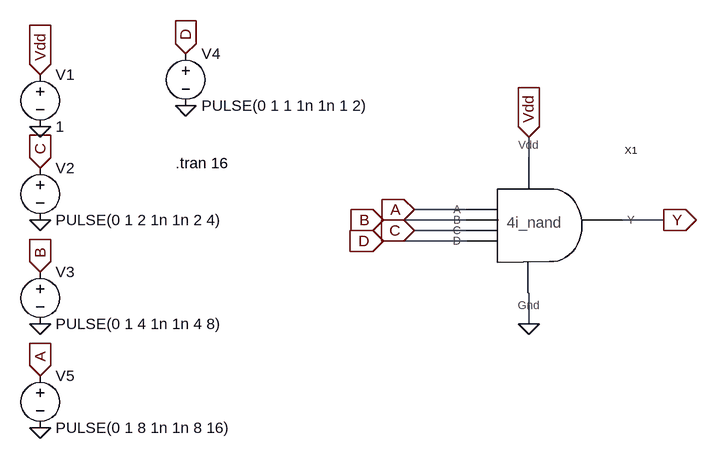
[diagram p0: schematic 4i_nand_test.asc]
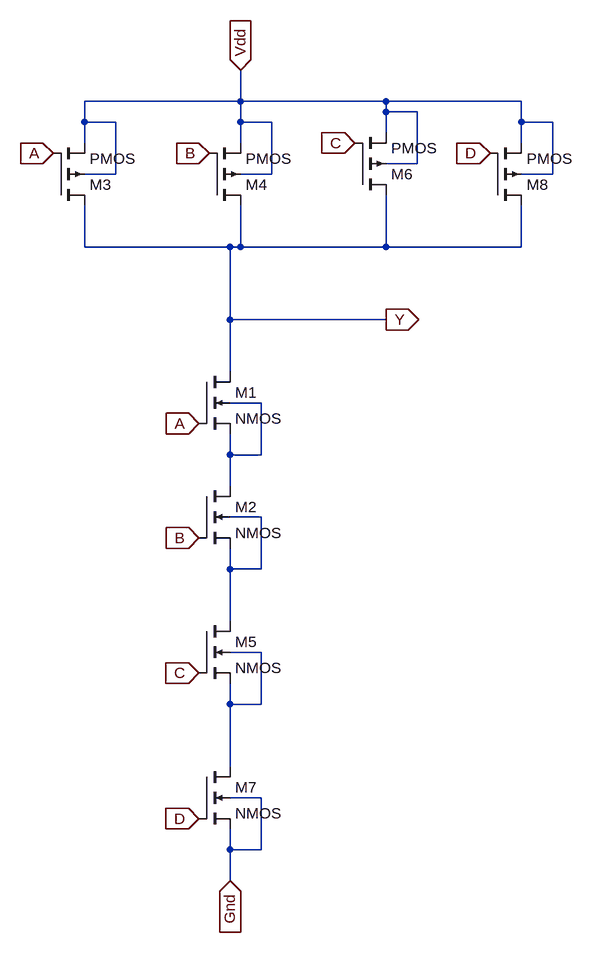
[diagram p1: sub-circuit 4inand.asc]
4i_nand_test.asc, the LTspice schematic file:
Version 4
SHEET 1 880 680
WIRE 288 64 288 32
WIRE 192 144 112 144
WIRE 192 160 64 160
WIRE 496 160 432 160
WIRE 192 176 112 176
WIRE 192 192 64 192
WIRE 288 320 288 272
FLAG 112 144 A
IOPIN 112 144 In
FLAG 64 160 B
IOPIN 64 160 In
FLAG 112 176 C
IOPIN 112 176 In
FLAG 64 192 D
IOPIN 64 192 In
FLAG 288 320 0
FLAG 288 32 Vdd
IOPIN 288 32 In
FLAG 496 160 Y
IOPIN 496 160 Out
FLAG -464 -64 Vdd
IOPIN -464 -64 In
FLAG -464 80 C
IOPIN -464 80 In
FLAG -464 240 B
IOPIN -464 240 In
FLAG -464 16 0
FLAG -464 160 0
FLAG -464 320 0
FLAG -240 -96 D
IOPIN -240 -96 In
FLAG -240 -16 0
FLAG -464 400 A
IOPIN -464 400 In
FLAG -464 480 0
SYMBOL 4inand 272 144 R0
SYMATTR InstName X1
SYMBOL voltage -464 -80 R0
SYMATTR InstName V1
SYMATTR Value 1
SYMBOL voltage -464 64 R0
WINDOW 123 0 0 Left 0
WINDOW 39 0 0 Left 0
SYMATTR InstName V2
SYMATTR Value PULSE(0 1 2 1n 1n 2 4)
SYMBOL voltage -464 224 R0
WINDOW 123 0 0 Left 0
WINDOW 39 0 0 Left 0
SYMATTR InstName V3
SYMATTR Value PULSE(0 1 4 1n 1n 4 8)
SYMBOL voltage -240 -112 R0
WINDOW 123 0 0 Left 0
WINDOW 39 0 0 Left 0
SYMATTR InstName V4
SYMATTR Value PULSE(0 1 1 1n 1n 1 2)
SYMBOL voltage -464 384 R0
WINDOW 123 0 0 Left 0
WINDOW 39 0 0 Left 0
SYMATTR InstName V5
SYMATTR Value PULSE(0 1 8 1n 1n 8 16)
TEXT -256 72 Left 2 !.tran 16

4inand.asc, the sub-circuit schematic file:
Version 4
SHEET 1 880 776
WIRE 112 -528 112 -576
WIRE 112 -528 -128 -528
WIRE 336 -528 112 -528
WIRE 544 -528 336 -528
WIRE 336 -512 336 -528
WIRE 384 -512 336 -512
WIRE -128 -496 -128 -528
WIRE -80 -496 -128 -496
WIRE 112 -496 112 -528
WIRE 160 -496 112 -496
WIRE 544 -496 544 -528
WIRE 592 -496 544 -496
WIRE 336 -480 336 -512
WIRE -128 -464 -128 -496
WIRE 112 -464 112 -496
WIRE 544 -464 544 -496
WIRE 384 -432 384 -512
WIRE 384 -432 336 -432
WIRE -80 -416 -80 -496
WIRE -80 -416 -128 -416
WIRE 160 -416 160 -496
WIRE 160 -416 112 -416
WIRE 592 -416 592 -496
WIRE 592 -416 544 -416
WIRE -128 -304 -128 -368
WIRE 96 -304 -128 -304
WIRE 112 -304 112 -368
WIRE 112 -304 96 -304
WIRE 336 -304 336 -384
WIRE 336 -304 112 -304
WIRE 544 -304 544 -368
WIRE 544 -304 336 -304
WIRE 96 -192 96 -304
WIRE 336 -192 96 -192
WIRE 96 -112 96 -192
WIRE 144 -64 96 -64
WIRE 96 16 96 -16
WIRE 144 16 144 -64
WIRE 144 16 96 16
WIRE 96 64 96 16
WIRE 144 112 96 112
WIRE 96 192 96 160
WIRE 144 192 144 112
WIRE 144 192 96 192
WIRE 96 272 96 192
WIRE 144 320 96 320
WIRE 96 400 96 368
WIRE 144 400 144 320
WIRE 144 400 96 400
WIRE 96 496 96 400
WIRE 144 544 96 544
WIRE 96 624 96 592
WIRE 144 624 144 544
WIRE 144 624 96 624
WIRE 96 672 96 624
FLAG 48 144 B
IOPIN 48 144 In
FLAG 48 -32 A
IOPIN 48 -32 In
FLAG -176 -448 A
IOPIN -176 -448 In
FLAG 64 -448 B
IOPIN 64 -448 In
FLAG 336 -192 Y
IOPIN 336 -192 Out
FLAG 112 -576 Vdd
IOPIN 112 -576 In
FLAG 48 352 C
IOPIN 48 352 In
FLAG 288 -464 C
IOPIN 288 -464 In
FLAG 96 672 Gnd
IOPIN 96 672 In
FLAG 48 576 D
IOPIN 48 576 In
FLAG 496 -448 D
IOPIN 496 -448 In
SYMBOL nmos4 48 -112 R0
SYMATTR InstName M1
SYMBOL nmos4 48 64 R0
SYMATTR InstName M2
SYMBOL pmos4 -176 -368 M180
SYMATTR InstName M3
SYMBOL pmos4 64 -368 M180
SYMATTR InstName M4
SYMBOL nmos4 48 272 R0
SYMATTR InstName M5
SYMBOL pmos4 288 -384 M180
SYMATTR InstName M6
SYMBOL nmos4 48 496 R0
SYMATTR InstName M7
SYMBOL pmos4 496 -368 M180
SYMATTR InstName M8

The netlist it stands for:
* 4i_nand_test.asc
XX1 A B C D Vdd 0 Y 4inand
V1 Vdd 0 1
V2 C 0 PULSE(0 1 2 1n 1n 2 4)
V3 B 0 PULSE(0 1 4 1n 1n 4 8)
V4 D 0 PULSE(0 1 1 1n 1n 1 2)
V5 A 0 PULSE(0 1 8 1n 1n 8 16)

* block symbol definitions
.subckt 4inand A B C D Vdd Gnd Y
M1 Y A N001 N001 NMOS
M2 N001 B N002 N002 NMOS
M3 Y A Vdd Vdd PMOS
M4 Y B Vdd Vdd PMOS
M5 N002 C N003 N003 NMOS
M6 Y C Vdd Vdd PMOS
M7 N003 D Gnd Gnd NMOS
M8 Y D Vdd Vdd PMOS
.ends 4inand

.model NMOS NMOS
.model PMOS PMOS
.lib standard.mos
.tran 16
.backanno
.end

* Results of the author's LTspice run, read from the files saved beside the schematic
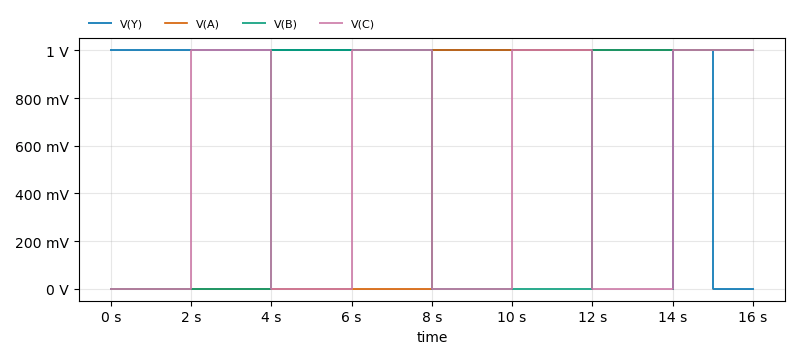
[diagram p2: Transient Analysis of 4i_nand_test.asc, plotted from the saved traces]
* Transient Analysis, 1 run:
*   V(Y): min 1.18 µV, max 1 V, average 937.5 mV, rms 968.2 mV, last 1.608 µV
*   V(A): min 0 V, max 1 V, average 500 mV, rms 707.1 mV, last 1 V
*   V(B): min 0 V, max 1 V, average 500 mV, rms 707.1 mV, last 1 V
*   V(C): min 0 V, max 1 V, average 500 mV, rms 707.1 mV, last 1 V